# EAGLE design A13-LCD4.3''_Rev_B (EAGLE 4.16)
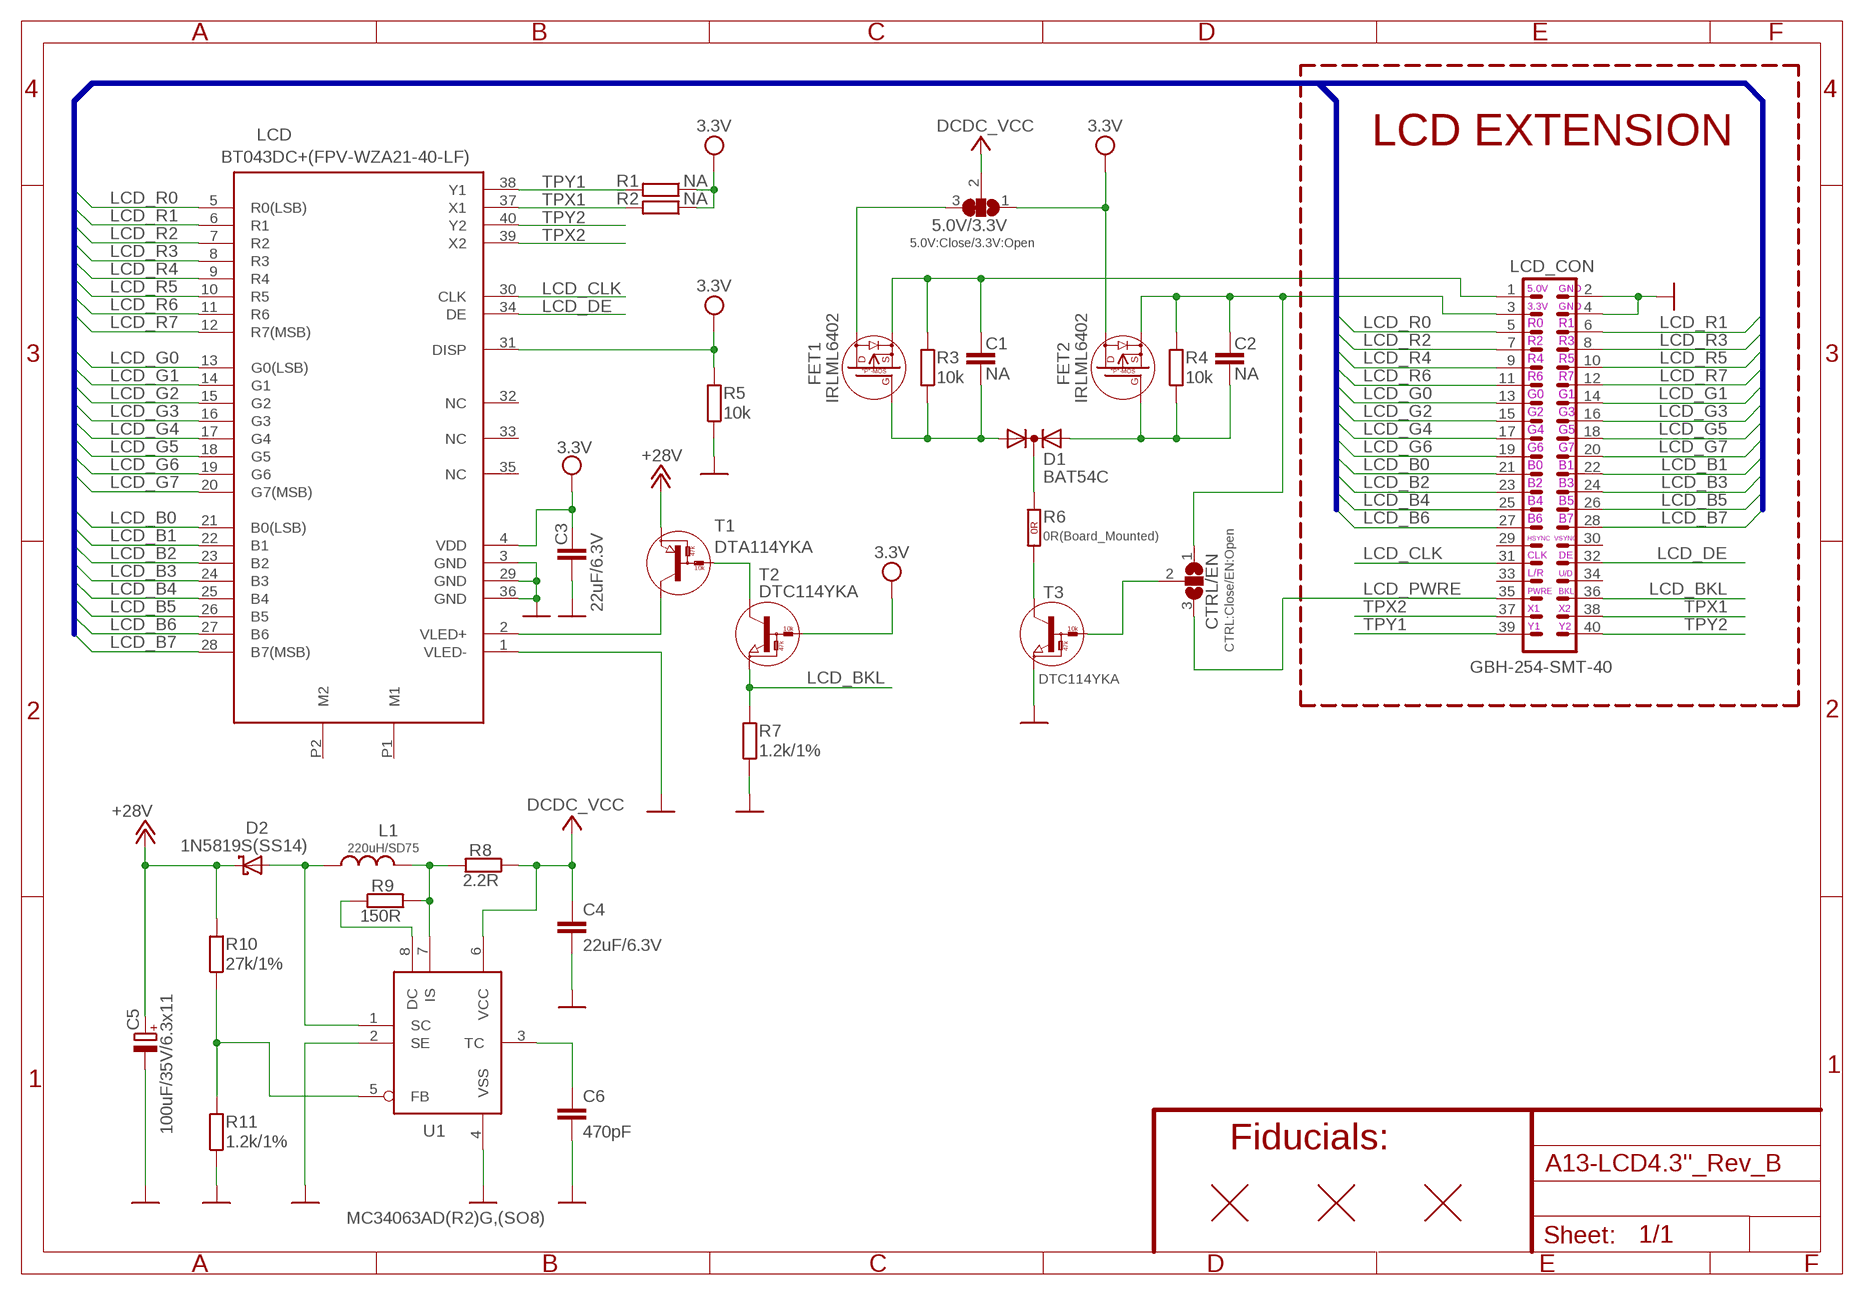
[diagram p0: schematic, sheet 1]

## Parts
5.0V/3.3V  5.0V:Close/3.3V:Open  SJ2W5  [SJ_2_SMALL_23_TIED]
C1  NA  C-EUC0603_DWS  [C0603_DWS]
C2  NA  C-EUC0603_DWS  [C0603_DWS]
C3  22uF/6.3V  C-EUC0603_DWS  [C0603_DWS]
C4  22uF/6.3V  C-EUC0603_DWS  [C0603_DWS]
C5  100uF/35V/6.3x11  CPOL-EUH1M  [CP6.3X11-H-M]
C6  470pF  C-EUC0603_DWS  [C0603_DWS]
CTRL/EN  CTRL:Close/EN:Open  SJ2W3  [SJ_2_SMALL]
D1  BAT54C  DIODE_AC-CA_  [SOT23C]
D2  1N5819S(SS14)  SCHOTKKY7.62SS2  [MLL-41]
FET1  IRLML6402  P-MOS+DIODIRLML6402  [SOT23]
FET2  IRLML6402  P-MOS+DIODIRLML6402  [SOT23]
L1  220uH/SD75  LCLXXUH_SD73  [CLXXUH_SD73]
LCD  BT043DC+(FPV-WZA21-40-LF)  GFT043A13-LCD4.3"  [FPV-WZA21-40-LF]
LCD_CON  GBH-254-SMT-40  ML40-GBH-254-SMT-40  [ML40-MALE(GBH-254-SMT-40)]
R1  NA  R-EU_R0603_5MIL_DWS  [R0603_5MIL_DWS]
R2  NA  R-EU_R0603_5MIL_DWS  [R0603_5MIL_DWS]
R3  10k  R-EU_R0603_5MIL_DWS  [R0603_5MIL_DWS]
R4  10k  R-EU_R0603_5MIL_DWS  [R0603_5MIL_DWS]
R5  10k  R-EU_R0603_5MIL_DWS  [R0603_5MIL_DWS]
R6  0R(Board_Mounted)  R_0R0R(NA)  [0603_0R]
R7  1.2k/1%  R-EU_R0603_5MIL_DWS  [R0603_5MIL_DWS]
R8  2.2R  R-EU_R0805_5MIL_DWS  [R0805_5MIL_DWS]
R9  150R  R-EU_R0603_5MIL_DWS  [R0603_5MIL_DWS]
R10  27k/1%  R-EU_R0603_5MIL_DWS  [R0603_5MIL_DWS]
R11  1.2k/1%  R-EU_R0603_5MIL_DWS  [R0603_5MIL_DWS]
T1  DTA114YKA  DIGITAL_TRANSISTORS-PNPDTA114YKA  [SOT-23]
T2  DTC114YKA  DIGITAL_TRANSISTORS-NPNDTC114YKA  [SOT-23]
T3  DTC114YKA  DIGITAL_TRANSISTORS-NPNDTC114YKA  [SOT-23]
U1  MC34063AD(R2)G,(SO8)  MC34063A2  [SO-8]
U$1  FIDUCIAL1X2  [FIDUCIAL-1X2]
U$2  FIDUCIAL1X2  [FIDUCIAL-1X2]
U$3  FIDUCIAL1X2  [FIDUCIAL-1X2]

## Nets
3.3VDC [pwr]: C2.1 CTRL/EN.1 FET2.2(S) LCD_CON.3 R4.2
5VDC: C1.1 FET1.2(S) LCD_CON.1 R3.2
+5V: 5.0V/3.3V.2 C4.1 R8.1 U1.6(VCC) ; supply symbol labelled DCDC_VCC
+12V: C5.+ D2.K(C) R10.2 T1.2(E) ; supply symbol labelled +28V
GND [pwr]: C3.2 C4.2 C5.- C6.2 LCD.1(VLED-) LCD.3(GND) LCD.29(GND) LCD.36(GND) LCD_CON.2 LCD_CON.4 R5.1 R7.1 R11.1 T3.2(E) U1.2(SE) U1.4(VSS)
LCD_B0: LCD.21(B0(LSB)) LCD_CON.21
LCD_B1: LCD.22(B1) LCD_CON.22
LCD_B2: LCD.23(B2) LCD_CON.23
LCD_B3: LCD.24(B3) LCD_CON.24
LCD_B4: LCD.25(B4) LCD_CON.25
LCD_B5: LCD.26(B5) LCD_CON.26
LCD_B6: LCD.27(B6) LCD_CON.27
LCD_B7: LCD.28(B7(MSB)) LCD_CON.28
LCD_BKL: LCD_CON.36 R7.2 T2.2(E)
LCD_CLK: LCD.30(CLK) LCD_CON.31
LCD_DE: LCD.34(DE) LCD_CON.32
LCD_G0: LCD.13(G0(LSB)) LCD_CON.13
LCD_G1: LCD.14(G1) LCD_CON.14
LCD_G2: LCD.15(G2) LCD_CON.15
LCD_G3: LCD.16(G3) LCD_CON.16
LCD_G4: LCD.17(G4) LCD_CON.17
LCD_G5: LCD.18(G5) LCD_CON.18
LCD_G6: LCD.19(G6) LCD_CON.19
LCD_G7: LCD.20(G7(MSB)) LCD_CON.20
LCD_PWRE: CTRL/EN.3 LCD_CON.35
LCD_R0: LCD.5(R0(LSB)) LCD_CON.5
LCD_R1: LCD.6(R1) LCD_CON.6
LCD_R2: LCD.7(R2) LCD_CON.7
LCD_R3: LCD.8(R3) LCD_CON.8
LCD_R4: LCD.9(R4) LCD_CON.9
LCD_R5: LCD.10(R5) LCD_CON.10
LCD_R6: LCD.11(R6) LCD_CON.11
LCD_R7: LCD.12(R7(MSB)) LCD_CON.12
N$1: 5.0V/3.3V.3 FET1.3(D)
N$2: T1.1(B) T2.3(C)
N$8: C2.2 D1.1(A1) FET2.1(G) R4.1
N$9: C1.2 D1.2(A2) FET1.1(G) R3.1
N$11: R6.2(1.2) T3.3(C)
N$16: CTRL/EN.2 T3.1(B)
N$19: D1.3(K) R6.1(1.1)
N$31: R10.1 R11.2 U1.5(FB)
N$64: C6.1 U1.3(TC)
N$65: D2.A L1.2 U1.1(SC)
N$74: L1.1 R8.2 R9.2 U1.7(IS)
N$81: R9.1 U1.8(DC)
TPX1: LCD.37(X1) LCD_CON.38 R2.2
TPX2: LCD.39(X2) LCD_CON.37
TPY1: LCD.38(Y1) LCD_CON.39 R1.2
TPY2: LCD.40(Y2) LCD_CON.40
VCC [pwr]: 5.0V/3.3V.1 C3.1 FET2.3(D) LCD.4(VDD) LCD.31(DISP) R1.1 R2.1 R5.2 T2.1(B) ; supply symbol labelled 3.3V
VLED+: LCD.2(VLED+) T1.3(C)
Unconnected: LCD.32(NC) LCD.33(NC) LCD.35(NC) LCD.P1(M1) LCD.P2(M2) LCD_CON.29 LCD_CON.30 LCD_CON.33 LCD_CON.34

## Buses
LCD_R[0..7],LCD_G[0..7],LCD_B[0..7]

## Notes on the sheet
- LCD EXTENSION
- 5.0V | GND
- 3.3V | GND
- R0 | R1
- R2 | R3
- R4 | R5
- R6 | R7
- G0 | G1
- G2 | G3
- G4 | G5
- G6 | G7
- B0 | B1
- B2 | B3
- B4 | B5
- B6 | B7
- HSYNC | VSYNC
- CLK | DE
- L/R | U/D
- PWRE | BKL
- X1 | X2
- Y1 | Y2
- Fiducials:

## Library data of the parts
5.0V/3.3V CTRL/EN = jumper:SJ2W: SMD solder JUMPER
C1-C4 C6 = rcl:C-EU: CAPACITOR, European symbol
C5 = rcl:CPOL-EU: POLARIZED CAPACITOR, European symbol
D1 = semicon-smd-ipc:DIODE_AC-CA_: DUAL DIODE
D2 = gogo:SCHOTKKY7.62SS
FET1 FET2 = Penko:P-MOS+DIOD
L1 = DOUBLE-SIDE:L
LCD = olimex_lcd:GFT043: Construction: 4.3 inches a-Si color TFT-LCD, White LED / CCFL Backlight and PCB. Resolution (pixel): 480(R.G.B) X272 Number of the Colors : 262K colors ( R , G , B 6 bit digital each) LCD type : Transmissive Color TFT LCD ( normally White) Interface: 40 pin pitch 0.5 FFC Power Supply Voltage: 3.3V single power input. Built-in power supply circuit. Viewing Direction:6 O`clock (The direction it`s hard to be discolored )
LCD_CON = con-harting-ml:ML40: HARTING
R1-R5 R7-R11 = rcl:R-EU_: RESISTOR, European symbol
R6 = OLIMEX_DISCRET:R_0R
T1 = OLIMEX_DISCRET:DIGITAL_TRANSISTORS-PNP: DTA114YKA Digital Transistor - PNP
T2 T3 = OLIMEX_DISCRET:DIGITAL_TRANSISTORS-NPN: DTC114YKA Digital Transistor - NPN
U1 = MPLAB_ICD2:MC34063A
U$1-U$3 = SparkFunEagle-6-6-07:FIDUCIAL: Fiducial Alignment Points Various fiducial points for machine vision alignment.

## Net classes
1 pwr: width 0.254 mm, drill 0.241 mm, clearance 0.254 mm

## Board
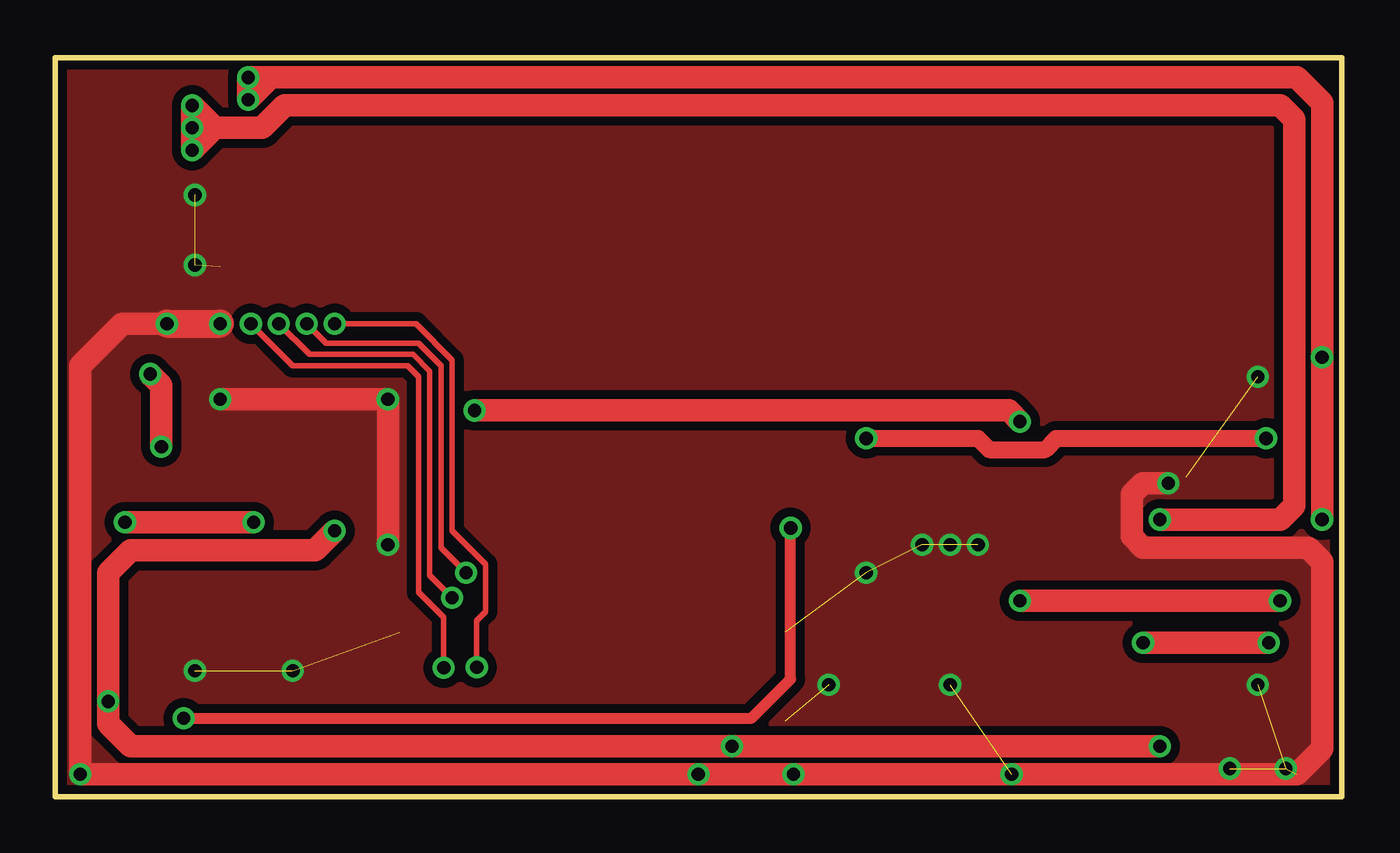
[diagram p1: board, top side]
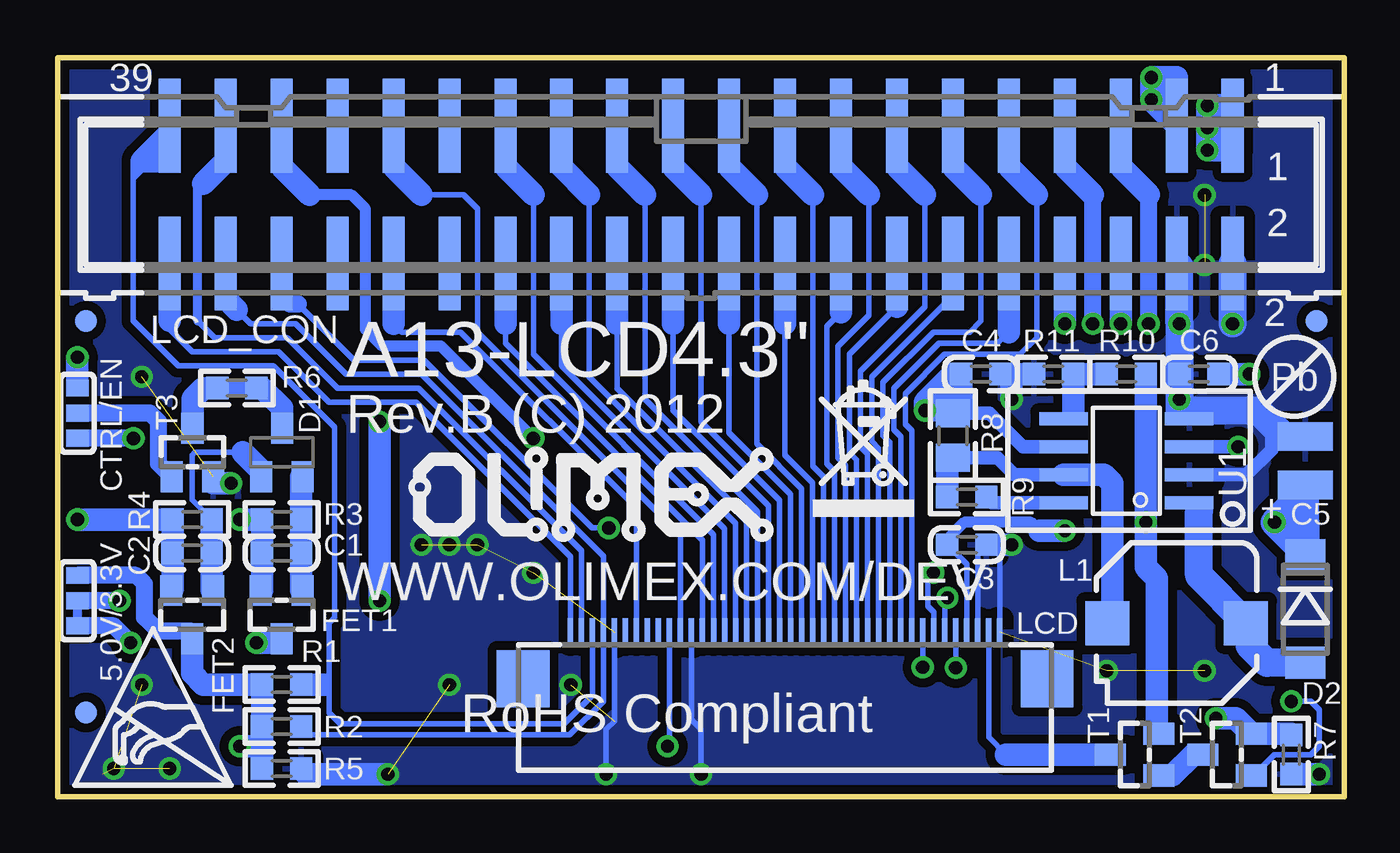
[diagram p2: board, bottom side, seen from below]

Size 58.42 x 33.53 mm. Coordinates in mm from the lower left corner, seen from the top.
Outline: 0,33.53 0,0 58.42,0 58.42,33.53 0,33.53
Copper layers (1+16): Top 0.035mm / dielectric 1.5mm / Bottom 0.035mm
Design rules "default": minimum track width 9.5mil, minimum drill 0.6mm, track to track 9.5mil, track to pad 9.5mil, pad to pad 9.5mil, via to via 10mil, smd to smd 1mil, copper to edge 10mil, drill to drill 8mil, minimum pad ring 8mil, minimum via ring 8mil, stop-mask expansion 4mil, vias tented up to drill 25mil, thermal gap 20mil

### Footprints (pad centres in the part's own frame; a part is rotated, then mirrored left to right if it is on the bottom)
SJ_2_SMALL_23_TIED = smd 0.762 x 1.016: 1 -1.143,0; 2 0,0; 3 1.143,0
C0603_DWS = smd 1.016 x 1.016: 1 -0.889,0; 2 0.889,0
CP6.3X11-H-M = smd 2.5 x 1.3: + 0,-1.1; - 0,1.1
SJ_2_SMALL = smd 0.762 x 1.016: 1 -1.143,0; 2 0,0; 3 1.143,0
SOT23C = smd 1 x 1.4: 1 -0.95,-1.1; 2 0.95,-1.1; 3 0,1.1
MLL-41 = smd 1.45 x 1.8: A 2.445,0; K -2.445,0
SOT23 = smd 1 x 1.4: 1 -0.95,-1.1; 2 0.95,-1.1; 3 0,1.1
CLXXUH_SD73 = smd 2 x 2: 1 0,3.15; 2 0,-3.15
FPV-WZA21-40-LF = smd 0.25 x 1.3: 1 -9.8,-0.85; 2 -9.3,-0.85; 3 -8.8,-0.85; 4 -8.3,-0.85; 5 -7.8,-0.85; 6 -7.3,-0.85; 7 -6.8,-0.85; 8 -6.3,-0.85; 9 -5.8,-0.85; 10 -5.3,-0.85; 11 -4.8,-0.85; 12 -4.3,-0.85; 13 -3.8,-0.85; 14 -3.3,-0.85; 15 -2.8,-0.85; 16 -2.3,-0.85; 17 -1.8,-0.85; 18 -1.3,-0.85; 19 -0.8,-0.85; 20 -0.3,-0.85; 21 0.2,-0.85; 22 0.7,-0.85; 23 1.2,-0.85; 24 1.7,-0.85; 25 2.2,-0.85; 26 2.7,-0.85; 27 3.2,-0.85; 28 3.7,-0.85; 29 4.2,-0.85; 30 4.7,-0.85; 31 5.2,-0.85; 32 5.7,-0.85; 33 6.2,-0.85; 34 6.7,-0.85; 35 7.2,-0.85; 36 7.7,-0.85; 37 8.2,-0.85; 38 8.7,-0.85; 39 9.2,-0.85; 40 9.7,-0.85 | smd 2.4 x 2.6: P1 -11.95,1.25; P2 11.85,1.25
ML40-MALE(GBH-254-SMT-40) = smd 1 x 4.25: 1 -24.13,-3.125; 2 -24.13,3.125; 3 -21.59,-3.125; 4 -21.59,3.125; 5 -19.05,-3.125; 6 -19.05,3.125; 7 -16.51,-3.125; 8 -16.51,3.125; 9 -13.97,-3.125; 10 -13.97,3.125; 11 -11.43,-3.125; 12 -11.43,3.125; 13 -8.89,-3.125; 14 -8.89,3.125; 15 -6.35,-3.125; 16 -6.35,3.125; 17 -3.81,-3.125; 18 -3.81,3.125; 19 -1.27,-3.125; 20 -1.27,3.125; 21 1.27,-3.125; 22 1.27,3.125; 23 3.81,-3.125; 24 3.81,3.125; 25 6.35,-3.125; 26 6.35,3.125; 27 8.89,-3.125; 28 8.89,3.125; 29 11.43,-3.125; 30 11.43,3.125; 31 13.97,-3.125; 32 13.97,3.125; 33 16.51,-3.125; 34 16.51,3.125; 35 19.05,-3.125; 36 19.05,3.125; 37 21.59,-3.125; 38 21.59,3.125; 39 24.13,-3.125; 40 24.13,3.125
R0603_5MIL_DWS = smd 1.016 x 1.016: 1 -0.889,0; 2 0.889,0
0603_0R = smd 1.016 x 1.016: 1 -0.889,0; 2 0.889,0
R0805_5MIL_DWS = smd 1.27 x 1.524: 1 -1.016,0; 2 1.016,0
SOT-23 = smd 1 x 1.4: 1 -0.95,-1.1; 2 0.95,-1.1; 3 0,1.1
SO-8 = smd 0.6 x 2.2: 1 -1.905,-2.854; 2 -0.635,-2.854; 3 0.635,-2.854; 4 1.905,-2.854; 5 1.905,2.854; 6 0.635,2.854; 7 -0.635,2.854; 8 -1.905,2.854
FIDUCIAL-1X2 = smd 1 x 1: 1 0,0

### Placement (x,y rotation side)
5.0V/3.3V  57.53,8.89 270 bottom
C1  48.26,11.05 0 bottom
C2  52.32,11.05 0 bottom
C3  17.14,11.43 0 bottom
C4  16.51,19.18 0 bottom
C5  1.78,15.24 0 bottom
C6  6.6,19.18 180 bottom
CTRL/EN  57.53,17.4 270 bottom
D1  48.24,15.62 0 bottom
D2  1.78,8.51 270 bottom
FET1  48.26,8.26 180 bottom
FET2  52.32,8.26 180 bottom
L1  7.62,7.87 90 bottom
LCD  25.45,6.6 180 bottom
LCD_CON  29.21,27.32 180 bottom
R1  48.26,5.08 0 bottom
R2  48.26,3.17 0 bottom
R3  48.26,12.57 180 bottom
R4  52.32,12.57 180 bottom
R5  48.26,1.27 180 bottom
R6  50.29,18.54 180 bottom
R7  2.41,1.91 90 bottom
R8  17.78,16.38 270 bottom
R9  17.14,13.59 180 bottom
R10  9.91,19.18 0 bottom
R11  13.21,19.18 0 bottom
T1  9.53,1.91 90 bottom
T2  5.33,1.91 90 bottom
T3  52.31,15.62 0 bottom
U1  9.91,15.24 90 bottom
U$1  57.15,3.81 270 bottom
U$2  57.15,21.59 270 bottom
U$3  1.27,21.59 270 bottom
U$4  [PB_SMALL]  2.29,19.05 0 bottom
U$8  [OLIMEX1_V]  24.77,11.45 0 bottom
U$10  [ESD_SYMBOL]  57.66,0.51 0 bottom
U$11  [RECYCLE_BIN1/8]  24.13,12.7 0 bottom

### Tracks (layer width: path | path; a pad name or v marks a point on that pad's centre or on a via)
3.3VDC  (via drill 0.6)
  Top 1.016: v57.53,12.57 v57.53,19.94 57.53,31.5 56.39,32.64 9.78,32.64 | 9.78,32.64 v8.76,32.64 v8.76,31.62 9.78,32.64
  Bottom 0.762: 57.53,18.67 CTRL/EN.1
  Bottom 1.016: FET2.2 53.21,9.42 C2.1 R4.2 v57.53,12.57 | v57.53,19.94 57.53,18.67 | LCD_CON.3 7.62,30.48 | 7.62,30.48 7.62,31.62 | 7.62,31.62 7.62,32.64 v8.76,32.64 v8.76,31.62 | 7.62,31.62 v8.76,31.62 | 7.62,30.48 v8.76,31.62
5VDC  (via drill 0.6)
  Top 1.016: v50.16,12.57 55.63,12.57 56.26,13.21 56.26,30.73 55.63,31.37 10.41,31.37 9.4,30.35 7.24,30.35 | v6.22,30.35 7.24,30.35 | v6.22,30.35 v6.22,31.37 7.24,30.35 | v6.22,30.35 v6.22,29.34 7.24,30.35
  Bottom 1.016: FET1.2 49.15,9.36 C1.1 R3.2 v50.16,12.57 | LCD_CON.1 5.08,30.35 | 5.08,30.35 v6.22,30.35 | v6.22,30.35 v6.22,31.37 5.08,31.37 5.08,30.35 | v6.22,30.35 v6.22,29.34 5.08,29.34 5.08,30.35
+5V  (via drill 0.6)
  Top 1.016: v19.05,17.53 43.18,17.53 43.31,17.53 v43.81,17.02 | v43.81,8.89 v55.63,8.89
  Bottom 0.61: U1.6 14.61,15.88 16.13,17.4 17.4,17.4
  Bottom 0.762: v55.63,8.89 5.0V/3.3V.2
  Bottom 1.016: 17.4,17.4 R8.1 | 17.4,17.4 C4.1 17.78,19.18 19.05,17.91 v19.05,17.53 | 17.4,17.4 17.4,17.53 v19.05,17.53 | v43.81,17.02 v43.81,8.89 | v19.05,17.53 17.78,18.8
+12V  (via drill 0.6)
  Top 1.016: v9.02,12.45 v3.17,12.45
  Bottom 1.016: R10.2 v9.02,12.45 9.02,10.41 8.51,9.91 8.51,2.94 T1.2
  Bottom 1.27: 1.78,11.05 D2.K | 1.78,12.45 1.78,11.05 | v3.17,12.45 1.78,12.45 | 1.78,12.45 1.78,13.84 | 1.78,13.84 C5.+ | v3.17,12.45 1.78,13.84 | v3.17,12.45 1.78,11.05
GND  (via drill 0.6)  (14 unrouted)
  Top 1.016: v7.49,18.03 v15.11,18.03 v15.11,11.43 | v5.08,21.46 3.05,21.46 1.14,19.56 v1.14,1.02 v29.21,1.02 v33.53,1.02 v43.43,1.02 56.39,1.02 57.53,2.16 57.53,10.67 56.9,11.3 49.4,11.3 48.9,11.81 48.9,13.72 49.4,14.22 v50.55,14.22
  Top 1.27: v5.08,21.46 v7.49,21.46
  Bottom 0.254: LCD.1 15.65,10.95 16.13,11.43 C3.2 16.38,11.43 16.65,11.16 LCD.3 | LCD.29 29.65,3.49 29.21,3.05 v29.21,1.02 | LCD.36 33.15,3.43 33.53,3.05 v33.53,1.02
  Bottom 0.508: 7.05,17.53 U1.4
  Bottom 0.61: U1.2 4.45,14.61 3.3,15.75 3.3,16.51 2.92,16.51
  Bottom 0.762: 7.49,24.07 LCD_CON.4
  Bottom 1.016: 15.11,19.18 R11.1 | 15.11,19.18 C4.2 | R7.1 v1.14,1.02 | v43.43,1.02 47.12,1.02 R5.1 | v15.11,18.03 15.11,19.18 | v15.11,11.43 C3.2 | T3.2 51.36,14.22 v50.55,14.22
  Bottom 1.27: C5.- 2.75,16.34 2.92,16.51 3.94,17.53 7.05,17.53 7.49,17.53 v7.49,18.03 C6.2 v7.49,21.46 7.49,24.07 | v5.08,21.46 LCD_CON.2
  other vias: 35.13,5.08 40.64,5.08 36.83,10.16 40.64,11.43 39.37,11.43 41.91,11.43 54.61,5.08 53.34,1.27 55.88,1.27 54.61,19.05 10.79,5.71 6.35,5.71 6.35,27.3 6.35,24.13
  pour Top (isolate 0.406, rank 2): -5.08,38.1 -5.08,-5.08 60.96,-5.08 60.96,38.1
  pour Bottom (isolate 0.406, rank 3): -2.54,-2.54 60.96,-2.54 60.96,35.56 -2.54,35.56
LCD_B0
  Bottom 0.254: LCD.21 25.65,13.46 29.21,17.02 29.21,27.3
  Bottom 1.016: LCD_CON.21 30.48,28.57 29.21,27.3
LCD_B1
  Bottom 0.254: LCD.22 26.15,13.2 30.48,17.53 30.48,21.46
  Bottom 1.016: 30.48,21.46 LCD_CON.22
LCD_B2
  Bottom 0.254: LCD.23 26.65,12.93 31.75,18.03 31.75,27.3
  Bottom 1.016: LCD_CON.23 33.02,28.57 31.75,27.3
LCD_B3
  Bottom 0.254: LCD.24 27.15,12.67 33.02,18.54 33.02,21.46
  Bottom 1.016: 33.02,21.46 LCD_CON.24
LCD_B4
  Bottom 0.254: LCD.25 27.65,12.41 34.29,19.05 34.29,27.3
  Bottom 1.016: LCD_CON.25 35.56,28.57 34.29,27.3
LCD_B5
  Bottom 0.254: LCD.26 28.15,12.15 35.56,19.56 35.56,21.46
  Bottom 1.016: 35.56,24.26 LCD_CON.26 35.56,21.46
LCD_B6
  Bottom 0.254: LCD.27 28.65,11.88 36.83,20.07 36.83,27.3
  Bottom 1.016: LCD_CON.27 38.1,28.57 36.83,27.3
LCD_B7
  Bottom 0.254: LCD.28 29.15,11.62 38.1,20.57 38.1,21.46
  Bottom 1.016: 38.1,24.26 LCD_CON.28 38.1,21.46
LCD_BKL  (via drill 0.6)
  Top 0.508: v5.84,3.56 31.62,3.56 33.4,5.33 v33.4,12.19
  Bottom 0.254: 47.5,22.35 44.96,19.81 41.78,19.81 34.16,12.19 v33.4,12.19
  Bottom 0.762: 47.5,22.35 47.88,22.35 48.26,22.73
  Bottom 1.016: R7.2 2.41,2.85 T2.2 4.93,3.56 v5.84,3.56 | 48.26,22.73 LCD_CON.36
LCD_CLK
  Bottom 0.254: LCD.30 30.15,11.86 39.37,21.08 39.37,26.67 40.01,27.3 41.91,27.3
  Bottom 1.016: LCD_CON.31 43.18,28.57 41.91,27.3
LCD_DE
  Bottom 0.254: LCD.34 32.15,13.1 40.13,21.08 42.8,21.08 43.18,21.46
  Bottom 1.016: 43.18,21.46 LCD_CON.32
LCD_G0
  Bottom 0.254: LCD.13 21.65,15.55 21.97,15.88 21.97,19.3 19.05,22.23 19.05,27.3
  Bottom 1.016: LCD_CON.13 20.32,28.57 19.05,27.3
LCD_G1
  Bottom 0.254: LCD.14 22.15,15.29 22.48,15.62 22.48,20.07 20.32,22.23
  Bottom 1.016: 20.32,22.23 LCD_CON.14
LCD_G2
  Bottom 0.254: LCD.15 22.65,15.03 22.99,15.37 22.99,20.45 21.59,21.84 21.59,27.3
  Bottom 1.016: LCD_CON.15 22.86,28.57 21.59,27.3
LCD_G3
  Bottom 0.254: LCD.16 23.15,14.77 23.5,15.11 23.5,21.34 22.86,21.97
  Bottom 1.016: 22.86,21.97 LCD_CON.16
LCD_G4
  Bottom 0.254: LCD.17 23.65,14.51 24.13,14.99 24.13,27.3
  Bottom 1.016: 24.13,27.3 25.4,28.57 LCD_CON.17
LCD_G5
  Bottom 0.254: LCD.18 24.15,14.24 25.4,15.49 25.4,21.46
  Bottom 1.016: 25.4,21.46 LCD_CON.18
LCD_G6
  Bottom 0.254: LCD.19 24.65,13.98 26.67,16 26.67,27.3
  Bottom 1.016: LCD_CON.19 27.94,28.57 26.67,27.3
LCD_G7
  Bottom 0.254: LCD.20 25.15,13.72 27.94,16.51 27.94,21.46
  Bottom 1.016: 27.94,21.46 LCD_CON.20
LCD_PWRE  (via drill 0.6)
  Top 0.762: v36.83,16.26 41.91,16.26 42.42,15.75 44.96,15.75 45.47,16.26 v54.99,16.26
  Bottom 0.508: 46.99,27.3 45.09,27.3 44.45,26.67 44.45,21.21 43.69,20.45 41.02,20.45 v36.83,16.26
  Bottom 0.762: v54.99,16.26 CTRL/EN.3
  Bottom 1.016: LCD_CON.35 48.26,28.57 46.99,27.3
LCD_R0  (via drill 0.6)
  Top 0.254: v8.89,21.46 10.79,19.56 16,19.56 16.51,19.05 16.51,9.27 17.65,8.13 v17.65,5.84
  Bottom 0.254: LCD.5 v17.65,5.84
  Bottom 0.762: v8.89,21.46 8.89,27.3
  Bottom 1.016: LCD_CON.5 10.16,28.57 8.89,27.3
LCD_R1  (via drill 0.6)
  Top 0.254: v10.16,21.46 11.56,20.07 16.26,20.07 17.02,19.3 17.02,10.03 v18.03,9.02
  Bottom 0.254: LCD.6 18.15,8.9 v18.03,9.02
  Bottom 1.016: v10.16,21.46 LCD_CON.6
LCD_R2  (via drill 0.6)
  Top 0.254: v18.67,10.16 17.53,11.3 17.53,19.56 16.51,20.57 12.32,20.57 v11.43,21.46
  Bottom 0.254: LCD.7 18.65,8.36 18.92,8.64 18.92,9.91 v18.67,10.16 18.65,10.18
  Bottom 0.762: v11.43,21.46 11.43,27.3
  Bottom 1.016: 11.43,27.3 12.7,28.57 LCD_CON.7
LCD_R3  (via drill 0.6)
  Top 0.254: v19.15,5.87 19.15,7.97 19.56,8.38 19.56,10.54 18.03,12.06 18.03,19.81 16.38,21.46 v12.7,21.46
  Bottom 0.254: LCD.8 v19.15,5.87
  Bottom 1.016: v12.7,21.46 LCD_CON.8
LCD_R4
  Bottom 0.254: LCD.9 19.65,16.6 19.94,16.89 19.94,18.29 18.16,20.07 14.73,20.07 13.97,20.83 13.97,27.3
  Bottom 1.016: 13.97,27.3 15.24,28.57 LCD_CON.9
LCD_R5
  Bottom 0.254: LCD.10 20.15,16.34 20.45,16.64 20.45,18.54 18.41,20.57 15.75,20.57 15.24,21.08
  Bottom 1.016: 15.24,21.08 LCD_CON.10
LCD_R6
  Bottom 0.254: LCD.11 20.65,16.08 20.95,16.38 20.95,18.8 18.67,21.08 17.02,21.08 16.51,21.59 16.51,27.3 | LCD_CON.11 17.78,30.48
  Bottom 1.016: 16.51,27.3 17.78,28.57 LCD_CON.11
LCD_R7
  Bottom 0.254: LCD.12 21.15,15.81 21.46,16.13 21.46,19.05 17.78,22.73 LCD_CON.12
N$1  (via drill 0.6)
  Top 1.016: v49.4,6.99 v55.12,6.99
  Bottom 0.762: 5.0V/3.3V.3 55.88,7.75 v55.12,6.99
  Bottom 1.016: FET1.3 48.26,6.99 v49.4,6.99
N$2
  Bottom 1.016: T2.3 6.86,1.91 7.81,0.95 T1.1
N$8
  Bottom 0.254: R4.1 52.32,13.46 52.32,15.49 52.2,15.62 50.04,15.62
  Bottom 1.016: FET2.1 51.44,9.36 C2.2 R4.1 | D1.1 49.2,14.78 50.04,15.62
N$9
  Bottom 1.016: FET1.1 47.37,9.36 C1.2 R3.1 47.37,14.52 D1.2
N$11
  Bottom 1.016: T3.3 52.31,18.05 51.82,18.54 R6.2
N$16
  Bottom 0.762: CTRL/EN.2 54.23,17.4 53.85,17.02 53.85,15.11 T3.1
N$19
  Bottom 1.016: D1.3 48.24,17.64 49.15,18.54 R6.1
N$31
  Bottom 0.61: U1.5 12.32,17.14 12.32,17.4
  Bottom 1.016: R10.1 R11.2 12.32,17.4
N$64  (via drill 0.6)
  Top 1.016: v4.83,15.88 4.83,18.67 v4.32,19.18
  Bottom 0.61: v4.83,15.88 U1.3
  Bottom 1.016: v4.32,19.18 C6.1
N$65
  Bottom 0.61: U1.1 6.6,13.34 6.6,12.95
  Bottom 1.27: D2.A 3.52,6.06 4.32,6.86 4.32,7.87 L1.2 4.47,7.9 6.6,10.03 6.6,12.95
N$74
  Bottom 0.61: U1.7 14.99,14.61 15.75,15.37 R8.2
  Bottom 1.016: R8.2 18.03,15.37 R9.2 | U1.7 10.92,14.61 10.54,14.22 10.54,7.87 L1.1
N$81
  Bottom 0.61: U1.8 16,13.34 R9.1
TPX1
  Bottom 0.254: R2.2 47.37,2.79 35.18,2.79 33.65,4.32 LCD.37 33.65,10.92 41.91,19.18 45.34,19.18 47.62,21.46 49.66,21.46 50.29,22.1
  Bottom 1.016: LCD_CON.38 50.8,22.61 50.29,22.1
TPX2
  Bottom 0.254: LCD.39 34.65,11.15 42.04,18.54 45.72,18.54 48.01,20.83 51.31,20.83 52.07,21.59
  Bottom 0.406: 52.07,21.59 52.07,27.56 51.82,27.81 | 50.8,28.83 LCD_CON.37
  Bottom 1.016: 51.82,27.81 50.8,28.83
TPY1
  Bottom 0.254: LCD.38 34.15,4.59 35.43,3.3 45.59,3.3 46.1,3.81 46.1,4.7 | 46.1,4.7 46.1,5.08 | 54.61,28.83 54.99,28.83 54.99,28.32 | 54.99,28.07 54.99,28.32 | 54.99,28.07 54.99,21.59 52.96,19.56 48.64,19.56 45.85,16.76 45.85,8.13 46.1,7.87 46.1,5.46 | 46.1,5.08 46.48,5.08 | 46.1,5.08 46.1,5.46 | 54.99,28.32 54.61,28.7 | 54.99,28.07 54.48,28.57 | 46.1,5.46 46.48,5.46 | 46.1,4.7 46.48,4.7
  Bottom 1.016: 53.34,30.1 53.34,28.83 54.61,28.83 53.34,30.1 | 53.34,30.1 LCD_CON.39 | 46.48,5.08 R1.2
TPY2
  Bottom 0.254: LCD.40 35.15,10.89 42.16,17.91 46.1,17.91 48.39,20.19 52.32,20.19 53.34,21.21 53.34,21.59
  Bottom 1.016: 53.34,21.59 LCD_CON.40
VCC  (via drill 0.6)
  Top 1.016: v50.16,2.29 v30.73,2.29 3.43,2.29 2.41,3.3 v2.41,4.32 2.41,10.16 3.43,11.18 11.81,11.18 v12.7,12.06
  Bottom 0.254: LCD.4 17.15,10.54 C3.1 | T2.1 4.12,0.95 3.17,1.91 1.52,1.91 1.14,2.29 1.14,3.94 1.52,4.32 v2.41,4.32 | LCD.31 30.65,2.37 v30.73,2.29
  Bottom 0.508: C3.1 18.03,11.68 17.27,12.45 14.22,12.45 13.84,12.06
  Bottom 0.762: 5.0V/3.3V.1 54.86,10.03 54.48,9.65 54.48,8.13 53.85,7.49 52.32,7.49 FET2.3
  Bottom 1.016: v12.7,12.06 13.84,12.06 | v50.16,2.29 49.15,2.29 R5.2 R2.1 R1.1 51.82,5.08 52.32,5.59 FET2.3
VLED+
  Bottom 0.254: LCD.2 16.15,2.69 15.37,1.91
  Bottom 1.016: T1.3 15.37,1.91

### Text on the board
bNames: 1 | 39 | 2 | A13-LCD4.3'' | Rev.B (C) 2012 | + | WWW.OLIMEX.COM/DEV | RoHS Compliant